# EAGLE design knxhome-lqfp32-v3 (EAGLE 9.4.0)
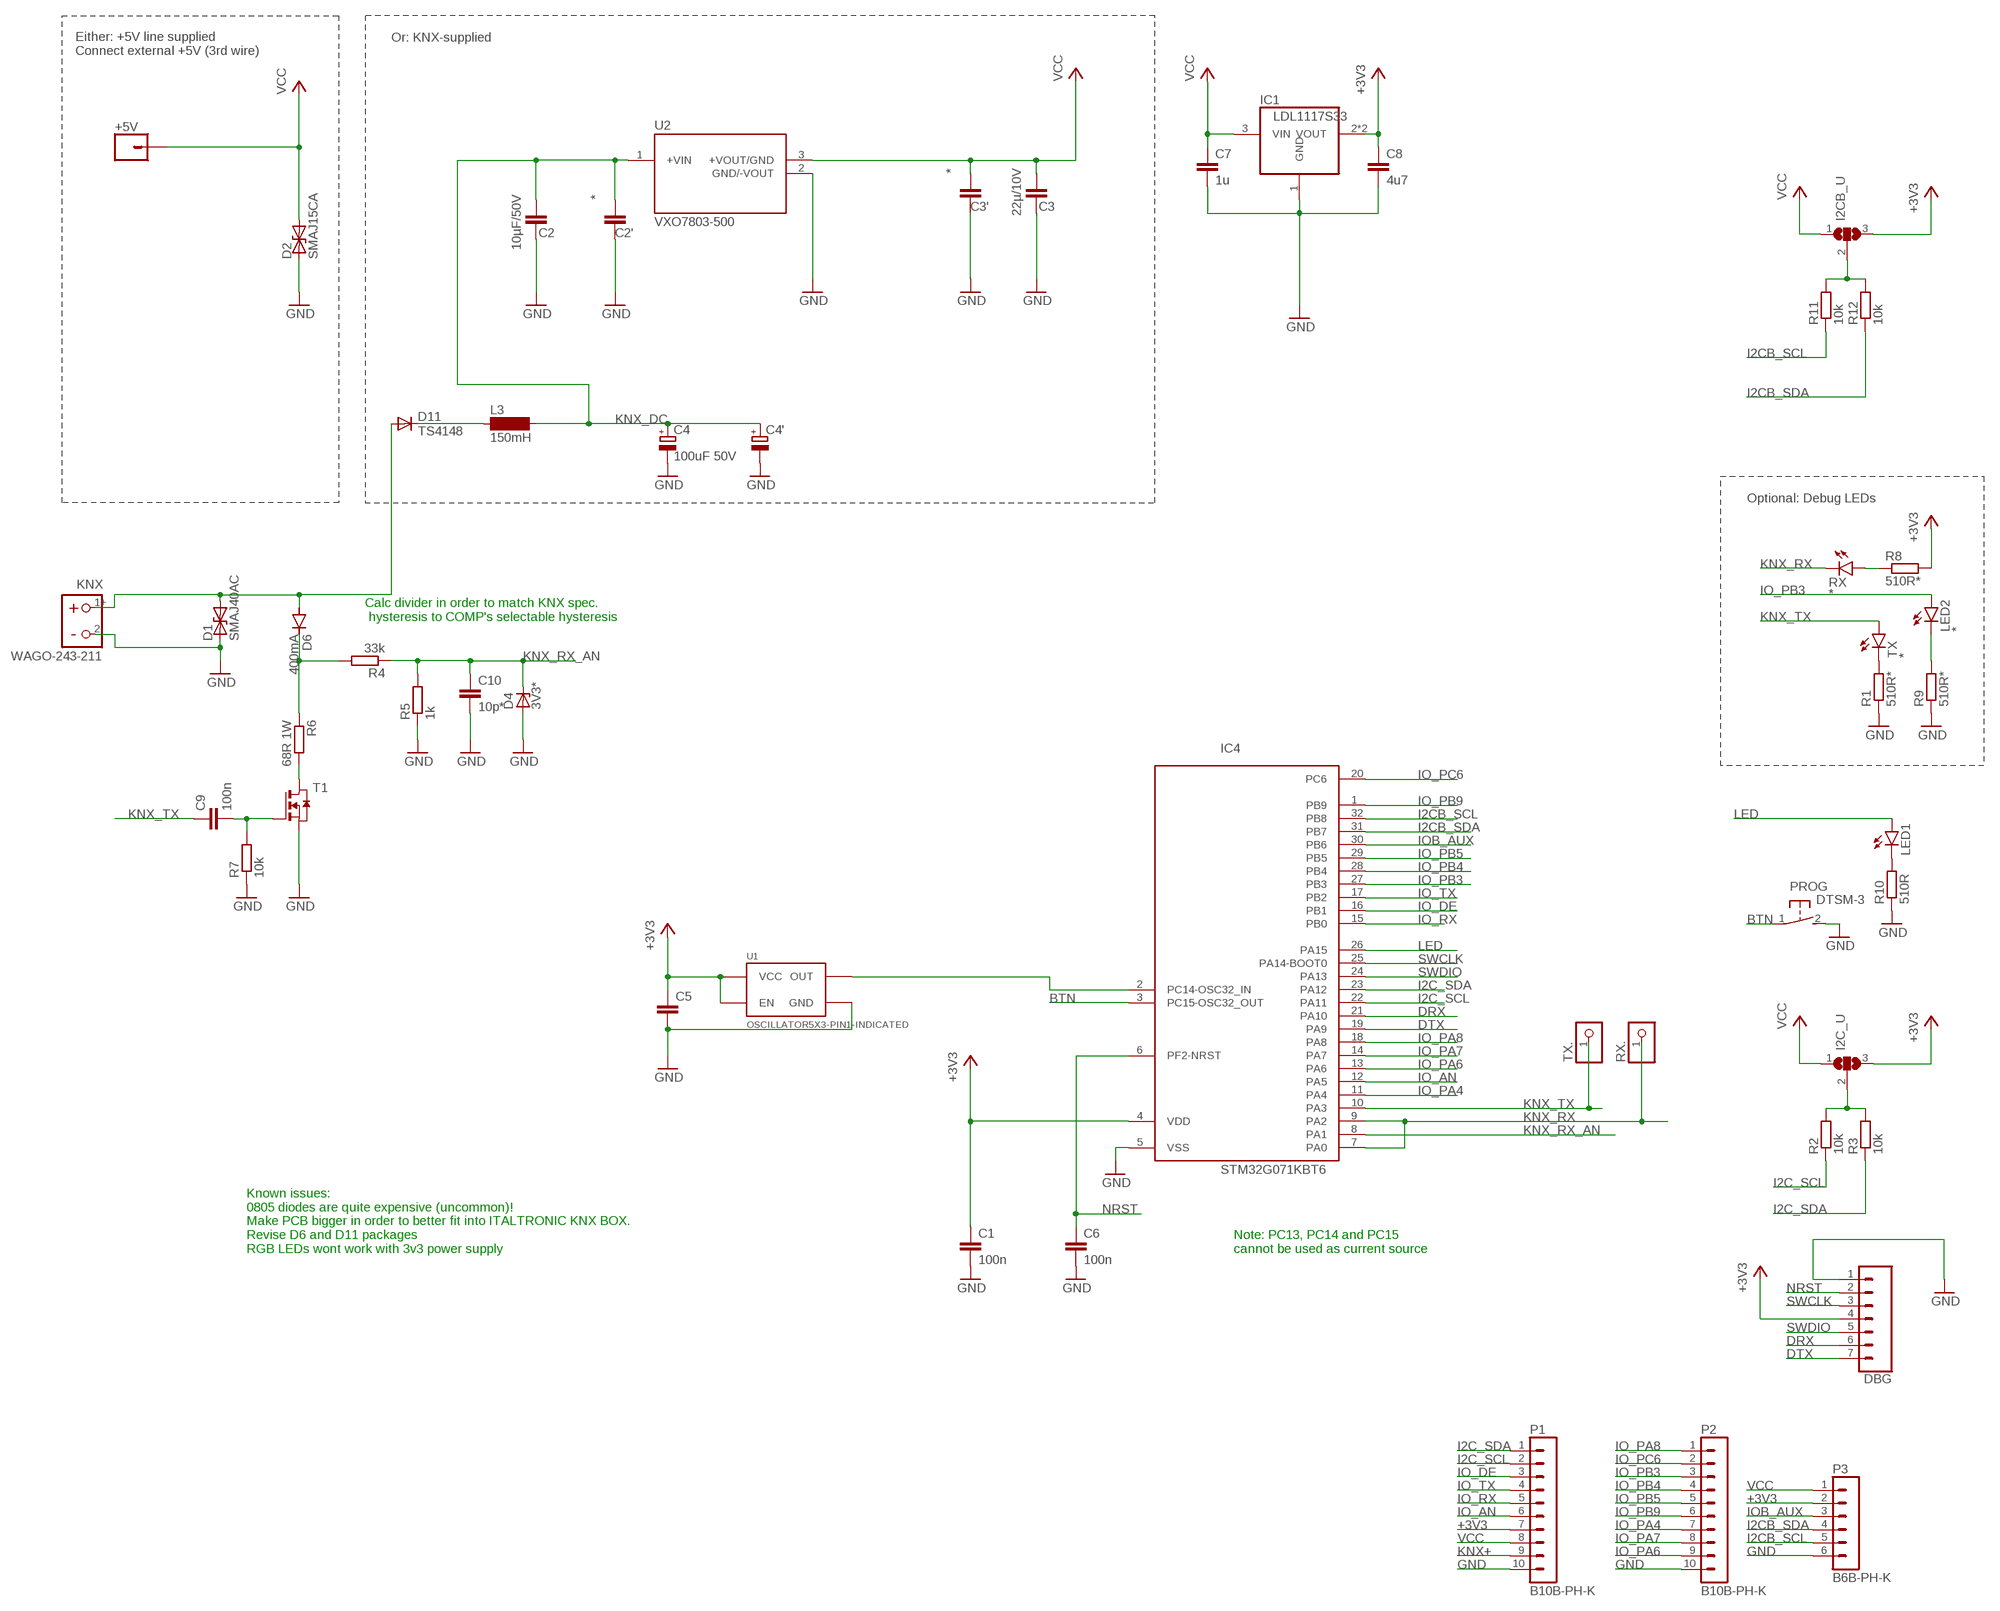
[diagram p0: schematic, sheet 1]

## Parts
+5V  CONN_01PTH_LONGPAD  [1X01_LONGPAD]
C1  100n  C-EUC0805  [C0805]
C2  10µF/50V  C-EUC1210  [C1210]
C2'  *  C-EUC1210  [C1210]
C3  22µ/10V  C-EUC1210  [C1210]
C3'  *  C-EUC1210  [C1210]
C4  100uF 50V  CPOL-EUE3.5-8  [E3,5-8]
C4'  CPOL-EU153CLV-0810  [153CLV-0810]
C5  C-EUC0805  [C0805]
C6  100n  C-EUC0805  [C0805]
C7  1u  C-EUC0805  [C0805]
C8  4u7  C-EUC0805  [C0805]
C9  100n  C-EUC0805  [C0805]
C10  10p*  C-EUC0805  [C0805]
D1  SMAJ40AC  [DO-214AC]
D2  SMAJ15CA  SMAJ40AC  [DO-214AC]
D4  3V3*  ZENER-DIODESOT23  [SOT23]
D6  400mA  DIODE-SOD123  [SOD123]
D11  TS4148  DIODE-SOD123  [SOD123]
DBG  CONN_07LOCK  [1X07_LOCK]
I2C_U  SJ2W  [SJ_2]
I2CB_U  SJ2W  [SJ_2]
IC1  LDL1117S33  REG1117  [SOT223]
IC4  STM32G071KBT6  [LQFP32]
KNX  WAGO-243-211  [WAGO-243-211]
L3  150mH  SD12BS11_LIEGEND  [BS11_LIEGEND]
LED1  LEDCHIPLED_1206  [CHIPLED_1206]
LED2  *  LEDCHIPLED_1206  [CHIPLED_1206]
P1  B10B-PH-K  [B10B-PH-K]
P2  B10B-PH-K  [B10B-PH-K]
P3  B6B-PH-K  [B6B-PH-K]
PROG  DTSM-3  [DTSM-3]
R1  510R*  R-EU_R0805  [R0805]
R2  10k  R-EU_R0805  [R0805]
R3  10k  R-EU_R0805  [R0805]
R4  33k  R-EU_R0805  [R0805]
R5  1k  R-EU_R0805  [R0805]
R6  68R 1W  R-EU_R2512  [R2512]
R7  10k  R-EU_R0805  [R0805]
R8  510R*  R-EU_R0805  [R0805]
R9  510R*  R-EU_R0805  [R0805]
R10  510R  R-EU_R0805  [R0805]
R11  10k  R-EU_R0805  [R0805]
R12  10k  R-EU_R0805  [R0805]
RX  *  LEDCHIPLED_1206  [CHIPLED_1206]
RX.  PINHD-1X1  [1X01]
T1  NMOSSOT23  [SOT-23]
TX  *  LEDCHIPLED_1206  [CHIPLED_1206]
TX.  PINHD-1X1  [1X01]
U1  OSCILLATOR5X3-PIN1-INDICATED  [CRYSTAL-OSC-SMD-5X3]
U2  VXO7803-500  [CONV_VXO7803-500]

## Nets
+3V3: C1.1 C5.1 C8.1 DBG.4 I2C_U.3 I2CB_U.3 IC1.2(VOUT) IC1.4(VOUT) IC4.4(VDD) P1.7 P3.2 R8.2 U1.1(EN) U1.4(VCC)
BTN: IC4.3(PC15-OSC32_OUT) PROG.1
DRX: DBG.6 IC4.21(PA10)
DTX: DBG.7 IC4.19(PA9)
GND: C1.2 C2'.1 C2.1 C3'.1 C3.1 C4'.- C4.- C5.2 C6.2 C7.2 C8.2 C10.2 D1.A D2.A D4.1(A) DBG.1 IC1.1(GND) IC4.5(VSS) KNX.2- P1.10 P2.10 P3.6 PROG.2 R1.1 R5.1 R7.1 R9.1 R10.1 T1.2(S) U1.2(GND) U2.2(GND/-VOUT)
I2C_PUP: I2C_U.2 R2.2 R3.2
I2C_PUP1: I2CB_U.2 R11.2 R12.2
I2C_SCL: IC4.22(PA11) P1.2 R2.1
I2C_SDA: IC4.23(PA12) P1.1 R3.1
I2CB_SCL: IC4.32(PB8) P3.5 R11.1
I2CB_SDA: IC4.31(PB7) P3.4 R12.1
IO_AN: IC4.12(PA5) P1.6
IO_DE: IC4.16(PB1) P1.3
IO_PA4: IC4.11(PA4) P2.7
IO_PA6: IC4.13(PA6) P2.9
IO_PA7: IC4.14(PA7) P2.8
IO_PA8: IC4.18(PA8) P2.1
IO_PB3: IC4.27(PB3) LED2.A P2.3
IO_PB4: IC4.28(PB4) P2.4
IO_PB5: IC4.29(PB5) P2.5
IO_PB9: IC4.1(PB9) P2.6
IO_PC6: IC4.20(PC6) P2.2
IO_RX: IC4.15(PB0) P1.5
IO_TX: IC4.17(PB2) P1.4
IOB_AUX: IC4.30(PB6) P3.3
KNX+ [power]: D1.C D6.A D11.A KNX.1+ P1.9
KNX_DC: C2'.2 C2.2 C4'.+ C4.+ L3.2 U2.1(+VIN)
KNX_RECT: D6.C R4.2 R6.1
KNX_RX: IC4.7(PA0) IC4.9(PA2) RX..1 RX.C
KNX_RX_AN: C10.1 D4.3(C) IC4.8(PA1) R4.1 R5.2
KNX_TX: C9.1 IC4.10(PA3) TX..1 TX.A
LED: IC4.26(PA15) LED1.A
N$1: D11.C L3.1
N$2: LED1.C R10.2
N$3: R1.2 TX.C
N$4: R8.1 RX.A
N$6: LED2.C R9.2
N$7: R6.2 T1.1(D)
N$8: C9.2 R7.2 T1.3(G)
NRST: C6.1 DBG.2 IC4.6(PF2-NRST)
OSC: IC4.2(PC14-OSC32_IN) U1.3(OUT)
SWCLK: DBG.3 IC4.25(PA14-BOOT0)
SWDIO: DBG.5 IC4.24(PA13)
VCC: +5V.1 C3'.2 C3.2 C7.1 D2.C I2C_U.1 I2CB_U.1 IC1.3(VIN) P1.8 P3.1 U2.3(+VOUT/GND)

## Notes on the sheet
- Or: KNX-supplied
- Either: +5V line supplied
  Connect external +5V (3rd wire)
- Optional: Debug LEDs
- Calc divider in order to match KNX spec.
   hysteresis to COMP's selectable hysteresis
- Known issues:
  0805 diodes are quite expensive (uncommon)!
  Make PCB bigger in order to better fit into ITALTRONIC KNX BOX.
  Revise D6 and D11 packages
  RGB LEDs wont work with 3v3 power supply
- Note: PC13, PC14 and PC15 
  cannot be used as current source

## Library data of the parts
+5V = SparkFun-Connectors:CONN_01: Single connection point. Often used as Generic Header-pin footprint for 0.1 inch spaced/style header connections On any of the 0.1 inch spaced packages, you can populate with these: Break Away Headers - Straight <https://www.sparkfun.com/products/116> (PRT-00116) Break Away Male Headers - Right Angle <https://www.sparkfun.com/products/553> (PRT-00553) Female Headers <https://www.sparkfun.com/products/115> (PRT-00115) Break Away Headers - Machine Pin <https://www.sparkfun.com/products/117> (PRT-00117) Break Away Female Headers - Swiss Machine Pin <https://www.sparkfun.com/products/743> (PRT-00743) This device is also useful as a general connection point to wire up your design to another part of your project. Our various solder wires solder well into these plated through hole pads. Hook-Up Wire - Assortment (Stranded, 22 AWG) <https://www.sparkfun.com/products/11375> (PRT-11375) Hook-Up Wire - Assortment (Solid Core, 22 AWG) <https://www.sparkfun.com/products/11367> (PRT-11367) View the entire wire category on our website here <https://www.sparkfun.com/categories/141> Special notes: SMTSO-256-ET is a "flush mount" nut for a 4-40 screw. We mostly use this on specialty testbeds; it is a nice way to connect hardware to your PCB at an adjustable hieght. Also note, the SNAP packages are for using a snappable style connector. We sell a baggie of snaps and they are also used on two LilyPad designs: Snap Assortment - 30 pack (male and female) <https://www.sparkfun.com/products/11347> (DEV-11347) LilyPad Arduino SimpleSnap <https://www.sparkfun.com/products/10941> (DEV-10941) LilyPad SimpleSnap Protoboard <https://www.sparkfun.com/products/10940> (DEV-10940)
C1 C2 C2' C3 C3' C5-C10 = rcl:C-EU: CAPACITOR, European symbol; SPICEPREFIX: C
C4 = rcl:CPOL-EU: POLARIZED CAPACITOR, European symbol
C4' = resistor:CPOL-EU: POLARIZED CAPACITOR, European symbol
D1 D2 = diode:SMAJ40AC
D4 = diode:ZENER-DIODE: Z-Diode
D6 D11 = diode:DIODE-: DIODE
DBG = SparkFun-Connectors:CONN_07: Multi connection point. Often used as Generic Header-pin footprint for 0.1 inch spaced/style header connections On any of the 0.1 inch spaced packages, you can populate with these: Break Away Headers - Straight <https://www.sparkfun.com/products/116> (PRT-00116) Break Away Male Headers - Right Angle <https://www.sparkfun.com/products/553> (PRT-00553) Female Headers <https://www.sparkfun.com/products/115> (PRT-00115) Break Away Headers - Machine Pin <https://www.sparkfun.com/products/117> (PRT-00117) Break Away Female Headers - Swiss Machine Pin <https://www.sparkfun.com/products/743> (PRT-00743) For SCREWTERMINALS and SPRING TERMINALS visit here: Screw Terimnals on SparkFun.com <https://www.sparkfun.com/search/results?term=Screw+Terminals> (5mm/3.5mm/2.54mm spacing) This device is also useful as a general connection point to wire up your design to another part of your project. Our various solder wires solder well into these plated through hole pads. Hook-Up Wire - Assortment (Stranded, 22 AWG) <https://www.sparkfun.com/products/11375> (PRT-11375) Hook-Up Wire - Assortment (Solid Core, 22 AWG) <https://www.sparkfun.com/products/11367> (PRT-11367) View the entire wire category on our website here <https://www.sparkfun.com/categories/141> Special notes: Molex polarized connector foot print use with SKU : PRT-08231 with associated crimp pins and housings. 1MM SMD Version SKU: PRT-10208 NOTES ON THE VARIANTS LOCK and LOCK_LONGPADS... This footprint was designed to help hold the alignment of a through-hole component (i.e. 6-pin header) while soldering it into place. You may notice that each hole has been shifted either up or down by 0.005 of an inch from it's more standard position (which is a perfectly straight line). This slight alteration caused the pins (the squares in the middle) to touch the edges of the holes. Because they are alternating, it causes a "brace" to hold the component in place. 0.005 has proven to be the perfect amount of "off-center" position when using our standard breakaway headers. Although looks a little odd when you look at the bare footprint, once you have a header in there, the alteration is very hard to notice. Also,if you push a header all the way into place, it is covered up entirely on the bottom side.
I2C_U I2CB_U = jumper:SJ2W: SMD solder JUMPER
IC1 = burr-brown:REG1117: 800mA and 1A Low Dropout (LDO) Positive Regulator 1.8V, 2.5V, 2.85V, 3.3V, 5V, and Adj; MPN: REG1117; OC_FARNELL: 1097566; OC_NEWARK: 14P6981
IC4 = stm32g0:STM32G071KBT
KNX = Connector_for_Selfbus-Projects:WAGO-243-211: WAGO KNX-Busklemme
L3 = inductor-neosid:SD12: INDUCTOR nominal inductance
LED1 LED2 RX TX = led:LED: LED OSRAM: - CHIPLED LG R971, LG N971, LY N971, LG Q971, LY Q971, LO R971, LY R971 LH N974, LH R974 LS Q976, LO Q976, LY Q976 LO Q996 - Hyper CHIPLED LW Q18S LB Q993, LB Q99A, LB R99A - SideLED LS A670, LO A670, LY A670, LG A670, LP A670 LB A673, LV A673, LT A673, LW A673 LH A674 LY A675 LS A676, LA A676, LO A676, LY A676, LW A676 LS A679, LY A679, LG A679 - Hyper Micro SIDELED® LS Y876, LA Y876, LO Y876, LY Y876 LT Y87S - SmartLED LW L88C, LW L88S LB L89C, LB L89S, LG L890 LS L89K, LO L89K, LY L89K LS L896, LA L896, LO L896, LY L896 - TOPLED LS T670, LO T670, LY T670, LG T670, LP T670 LSG T670, LSP T670, LSY T670, LOP T670, LYG T670 LG T671, LOG T671, LSG T671 LB T673, LV T673, LT T673, LW T673 LH T674 LS T676, LA T676, LO T676, LY T676, LB T676, LH T676, LSB T676, LW T676 LB T67C, LV T67C, LT T67C, LS T67K, LO T67K, LY T67K, LW E67C LS E67B, LA E67B, LO E67B, LY E67B, LB E67C, LV E67C, LT E67C LW T67C LS T679, LY T679, LG T679 LS T770, LO T770, LY T770, LG T770, LP T770 LB T773, LV T773, LT T773, LW T773 LH T774 LS E675, LA E675, LY E675, LS T675 LS T776, LA T776, LO T776, LY T776, LB T776 LHGB T686 LT T68C, LB T68C - Hyper Mini TOPLED® LB M676 - Mini TOPLED Santana® LG M470 LS M47K, LO M47K, LY M47K Source: http://www.osram.convergy.de LUXEON: - LUMILED® LXK2-PW12-R00, LXK2-PW12-S00, LXK2-PW14-U00, LXK2-PW14-V00 LXK2-PM12-R00, LXK2-PM12-S00, LXK2-PM14-U00 LXK2-PE12-Q00, LXK2-PE12-R00, LXK2-PE12-S00, LXK2-PE14-T00, LXK2-PE14-U00 LXK2-PB12-K00, LXK2-PB12-L00, LXK2-PB12-M00, LXK2-PB14-N00, LXK2-PB14-P00, LXK2-PB14-Q00 LXK2-PR12-L00, LXK2-PR12-M00, LXK2-PR14-Q00, LXK2-PR14-R00 LXK2-PD12-Q00, LXK2-PD12-R00, LXK2-PD12-S00 LXK2-PH12-R00, LXK2-PH12-S00 LXK2-PL12-P00, LXK2-PL12-Q00, LXK2-PL12-R00 Source: www.luxeon.com KINGBRIGHT: KA-3528ASYC Source: www.kingbright.com
P1 P2 = con-jst-ph:B10B-PH-K: HEADER
P3 = con-jst-ph:B6B-PH-K: HEADER
PROG = switch-tact:DTSM-3
R1-R12 = rcl:R-EU_: RESISTOR, European symbol; SPICEPREFIX: R
RX. TX. = pinhead:PINHD-1X1: PIN HEADER
T1 = zetex:NMOSSOT23: MOS FET; OC_FARNELL: unknown; OC_NEWARK: unknown
U1 = SparkFun-FreqCtrl:OSCILLATOR: Generic 5x3 and 7x5 oscillators
U2 = VXO7803-500:VXO7803-500; MANUFACTURER: CUI Inc; PARTREV: 1.0; STANDARD: Manufacturer recommendations

## Net classes
1 power: width 0.305 mm

## Board
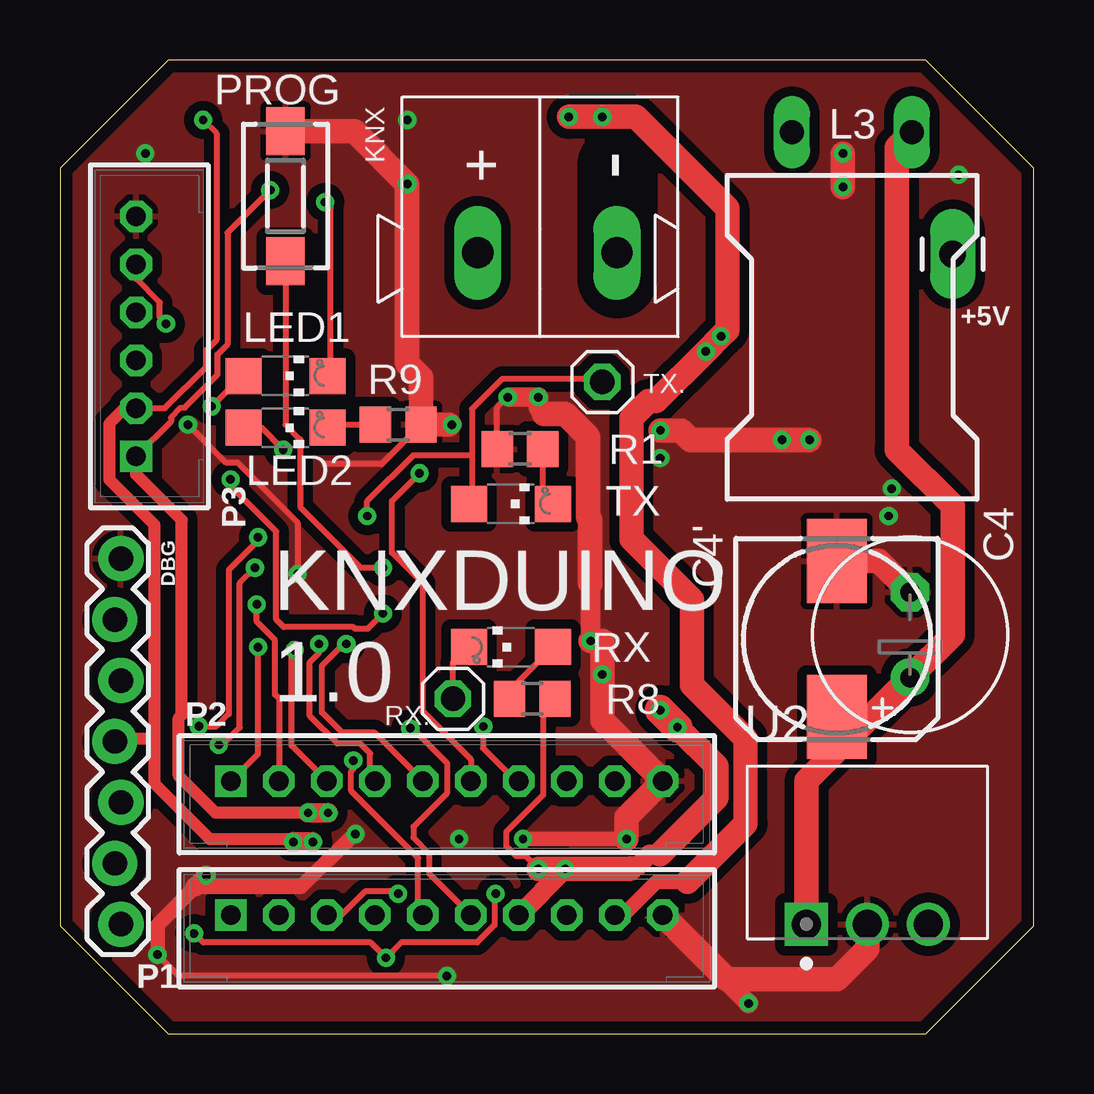
[diagram p1: board, top side]
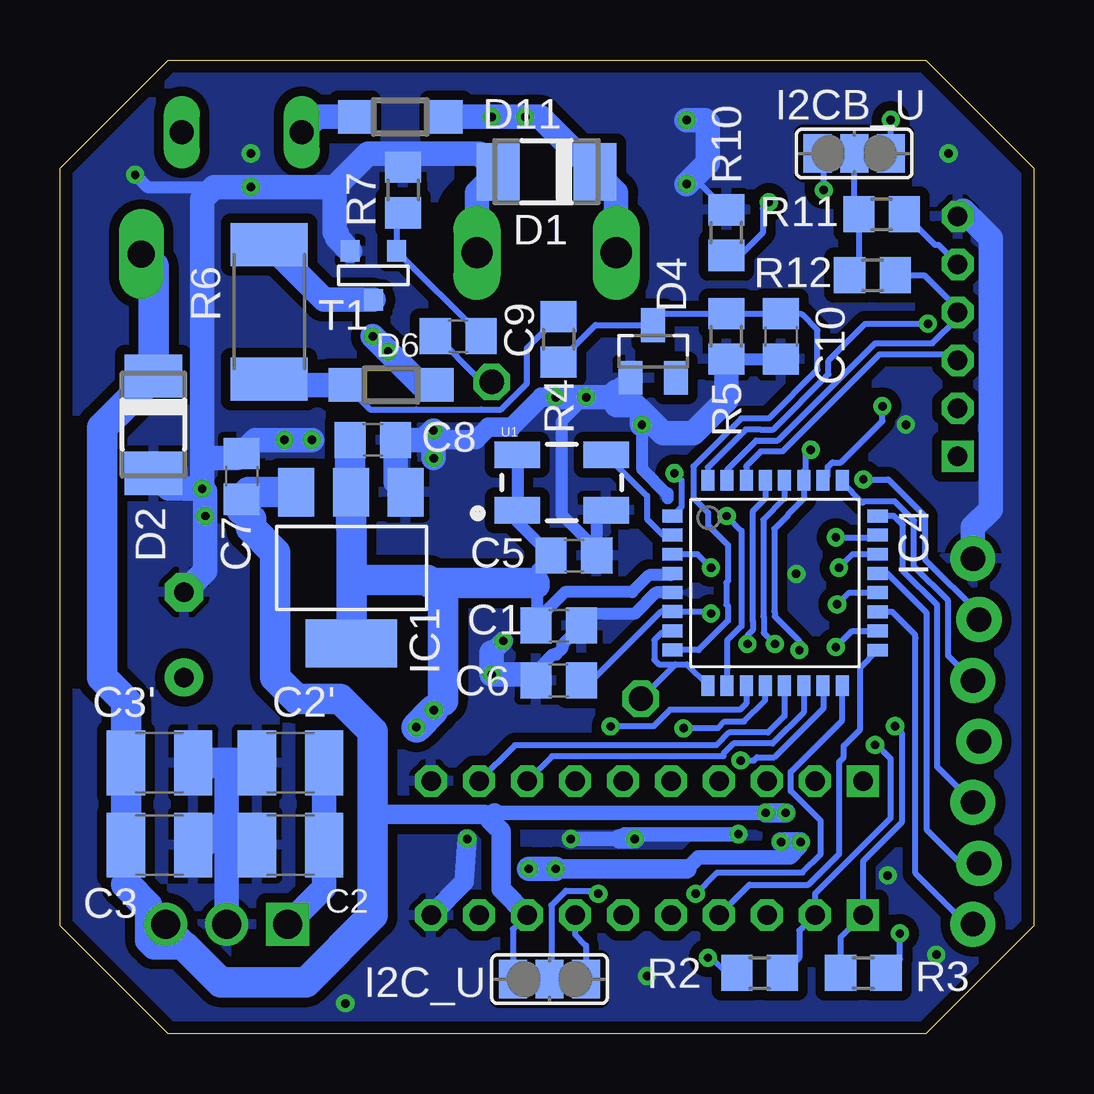
[diagram p2: board, bottom side, seen from below]

Size 40.6 x 40.6 mm. Coordinates in mm from the lower left corner, seen from the top.
Outline: 40.6,4.5 40.6,36.1 36.1,40.6 4.5,40.6 0,36.1 0,4.5 4.5,0 36.1,0 40.6,4.5
Copper layers (1*16): Top 0.035mm / dielectric 1.5mm / Bottom 0.035mm
Design rules "default *": minimum track width 8mil, minimum drill 0.35mm, track to track 8mil, track to pad 8mil, pad to pad 6mil, via to via 8mil, smd to smd 6mil, copper to edge 20mil, drill to drill 6mil, minimum pad ring 10mil, minimum via ring 8mil, stop-mask expansion 4mil, vias tented up to drill 40mil, thermal gap 10mil
tRestrict: 1 lines
bRestrict: 3 lines

### Footprints (pad centres in the part's own frame; a part is rotated, then mirrored left to right if it is on the bottom)
1X01_LONGPAD = drill 1.118 pad 1.88 long: 1 0,0
C0805 = smd 1.3 x 1.5: 1 -0.95,0; 2 0.95,0
C1210 = smd 1.6 x 2.7: 1 -1.4,0; 2 1.4,0
E3,5-8 = drill 0.813 pad 1.6: + -1.778,0 | drill 0.813 pad 1.6 octagon: - 1.778,0
153CLV-0810 = smd 3.5 x 2.5: + 3.25,0; - -3.25,0
DO-214AC = smd 1.8 x 2.4: A 2.025,0; C -2.025,0
SOT23 = smd 1 x 1.4: 1 -0.95,-1.1; 2 0.95,-1.1; 3 0,1.1
SOD123 = smd 1.4 x 1.4: A 1.9,0; C -1.9,0
1X07_LOCK = drill 1.016 pad 1.88: 1 0,0.127; 2 2.54,-0.127; 3 5.08,0.127; 4 7.62,-0.127; 5 10.16,0.127; 6 12.7,-0.127; 7 15.24,0.127
SJ_2 = smd 1.168 x 1.6: 1 -1.524,0; 2 0,0; 3 1.524,0
SOT223 = smd 1.499 x 2.007: 1 -2.261,-3.15; 2 0.025,-3.15; 3 2.311,-3.15 | smd 3.81 x 2.007: 4 0,3.15
LQFP32 = smd 0.54 x 0.85: 1 -2.8,-4.275; 2 -2,-4.275; 3 -1.2,-4.275; 4 -0.4,-4.275; 5 0.4,-4.275; 6 1.19,-4.275; 7 1.99,-4.275; 8 2.79,-4.275; 17 2.8,4.275; 18 2,4.275; 19 1.2,4.275; 20 0.4,4.275; 21 -0.4,4.275; 22 -1.2,4.275; 23 -2,4.275; 24 -2.8,4.275 | smd 0.85 x 0.54: 9 4.275,-2.8; 10 4.275,-2; 11 4.275,-1.2; 12 4.275,-0.4; 13 4.275,0.4; 14 4.275,1.2; 15 4.275,2; 16 4.275,2.8; 25 -4.275,2.8; 26 -4.275,2; 27 -4.275,1.2; 28 -4.275,0.4; 29 -4.275,-0.4; 30 -4.275,-1.2; 31 -4.275,-2; 32 -4.275,-2.8
WAGO-243-211 = drill 1.3 long: 1+ 0,2.65; 2- 0,-3.15
BS11_LIEGEND = drill 1 long: 1 -2.5,0; 2 2.5,0
CHIPLED_1206 = smd 1.5 x 1.5: A 0,-1.75; C 0,1.75
B10B-PH-K = drill 0.813 square: 1 -9,0 | drill 0.813 octagon: 2 -7,0; 3 -5,0; 4 -3,0; 5 -1,0; 6 1,0; 7 3,0; 8 5,0; 9 7,0; 10 9,0
B6B-PH-K = drill 0.813 square: 1 -5,0 | drill 0.813 octagon: 2 -3,0; 3 -1,0; 4 1,0; 5 3,0; 6 5,0
DTSM-3 = smd 2 x 1.6: 1 -2.7,0; 2 2.7,0
R0805 = smd 1.3 x 1.5: 1 -0.95,0; 2 0.95,0
R2512 = smd 1.8 x 3.2: 1 -2.8,0; 2 2.8,0
1X01 = drill 1.016 octagon: 1 0,0
SOT-23 = smd 0.787 x 0.889: 1 0.025,-1.016; 2 -0.94,1.016; 3 0.991,1.016
CRYSTAL-OSC-SMD-5X3 = smd 1.9 x 1.1: 1 -1.85,-1.15; 2 1.85,-1.15; 3 1.85,1.15; 4 -1.85,1.15
CONV_VXO7803-500 = drill 1.2 square: 1 0,0 | drill 1.2: 2 2.54,0; 3 5.08,0

### Placement (x,y rotation side)
+5V  37.21,32.51 180 top
C1  19.81,17.02 0 bottom
C2  30.99,7.87 0 bottom
C2'  30.99,11.3 0 bottom
C3  36.45,7.87 180 bottom
C3'  36.45,11.3 180 bottom
C4  35.43,16.64 90 top
C4'  32.38,16.46 270 top
C5  19.18,19.94 0 bottom
C6  19.81,14.73 180 bottom
C7  33.02,23.24 90 bottom
C8  27.56,24.77 0 bottom
C9  24,29.08 0 bottom
C10  10.54,29.08 270 bottom
D1  20.32,35.94 180 bottom
D2  36.7,25.4 270 bottom
D4  15.88,28.45 0 bottom
D6  26.8,27.05 0 bottom
D11  26.42,38.23 0 bottom
DBG  2.41,19.81 270 top
I2C_U  20.19,2.29 0 bottom
I2CB_U  7.49,36.7 0 bottom
IC1  28.45,19.43 180 bottom
IC4  10.79,18.8 270 bottom
KNX  20.07,32.56 90 top
L3  33.02,37.59 0 top
LED1  9.4,27.43 270 top
LED2  9.4,25.27 270 top
P1  16.13,4.95 0 top
P2  16.13,10.54 0 top
P3  3.17,29.08 90 top
PROG  9.4,34.92 90 top
R1  19.18,24.38 0 top
R2  11.43,2.54 180 bottom
R3  7.11,2.54 0 bottom
R4  19.81,28.96 90 bottom
R5  12.83,29.08 90 bottom
R6  31.88,30.1 90 bottom
R7  26.29,35.18 270 bottom
R8  19.68,13.97 0 top
R9  14.1,25.4 180 top
R10  12.83,33.4 270 bottom
R11  6.35,34.16 180 bottom
R12  6.73,31.62 180 bottom
RX  18.8,16.13 90 top
RX.  16.38,13.97 0 top
T1  27.56,31.62 0 bottom
TX  18.8,22.1 270 top
TX.  22.61,27.18 0 top
U1  19.68,22.99 0 bottom
U2  31.11,4.57 0 top

### Tracks (layer width: path | path; a pad name or v marks a point on that pad's centre or on a via)
+3V3  (via drill 0.35)
  Top 0.254: R8.2 20.14,13.47 20.14,9.96 18.6,8.42 18.6,7.83 19.01,7.42 19.4,7.42 v19.94,6.88 | P3.2 4.37,26.08 6.11,27.83 6.11,28.51 6.53,28.93 6.53,37.54 v5.97,38.1
  Top 0.508: v9.72,8 9.6,8.13 6.25,8.13 3.94,10.44 3.94,12.32 | P3.2 2.7,26.08 2.06,25.44 2.06,23.11 3.94,21.23 3.94,12.32 | DBG.4 2.41,12.32 3.94,12.32
  Top 0.813: P1.7 v21.06,6.88 | v9.72,8 v10.54,8 | 23.78,6.91 23.88,7.01 24.09,7.01 24.57,7.49 25.02,7.49
  Top 1.016: v25.74,12.78 27.36,11.17 27.36,9.83 25.02,7.49 | v19.94,6.88 v21.06,6.88 23.75,6.88 23.78,6.91
  Top 1.27: v25.02,13.5 v25.74,12.78
  Bottom 0.254: P1.7 19.13,4.14 18.67,3.68 I2C_U.3 | I2CB_U.3 v5.97,38.1
  Bottom 0.508: U1.4 U1.1 21.54,21.35 C5.1 20.7,19.36 20.7,18.67 20.7,17.08 C1.1 20.76,17.21 19.56,18.41 16.75,18.41 16.05,19.12 15.14,19.12 IC4.4
  Bottom 0.61: 14.46,6.88 13.98,7.37 10.16,7.37 9.72,7.8 v9.72,8
  Bottom 0.813: v19.94,6.88 14.46,6.88 | v9.72,8 v10.54,8
  Bottom 1.016: IC1.2 28.51,22.62 | 24.64,18.29 25.15,18.8 25.27,18.92 | v25.02,13.5 24.64,13.88 | 20.83,18.8 20.7,18.67 | v21.06,6.88 v19.94,6.88 | 28.47,21.11 28.45,21.08
  Bottom 1.27: 28.51,22.62 C8.1 | 24.64,18.29 24.64,13.88 | 25.15,18.8 20.83,18.8 | IC1.4 28.45,18.92 | 28.45,18.92 28.45,21.08 | IC1.2 28.47,21.11 | 25.27,18.92 28.45,18.92 | v25.02,13.5 v25.74,12.78
BTN  (via drill 0.35)
  Top 0.254: PROG.1 9.53,32.1 9.4,31.97 9.4,25.4 10.01,24.79 10.01,21.98 12.55,19.43 v13.46,19.43
  Bottom 0.254: IC4.3 14.03,20 v13.46,19.43
DRX
  Bottom 0.254: DBG.6 3.07,7.11 4.49,8.53 4.49,17.57 6.12,19.2 IC4.21
DTX
  Bottom 0.254: DBG.7 2.81,4.57 4.94,6.7 4.94,16.5 4.95,16.51 4.95,16.64 5.91,17.6 IC4.19
GND  (via drill 0.35)
  Top 0.254: v16.13,2.41 4.95,2.41 v4.06,3.3 | R1.1 18.23,26.1 v18.67,26.54 | v5.33,25.4 6.91,23.82 7.41,23.82 9.91,21.32 v9.91,19.18 | R9.1 13.4,23.75 11.05,23.75
  Top 0.61: v23.62,8.13 v19.3,8.13 | v4.06,3.3 4.06,4.55 5.63,6.12 10.06,6.12 12.27,8.33 v12.32,8.33
  Top 0.813: 22.12,18.78 v22.12,16.38 | 20.18,25.84 19.94,26.09 v19.94,26.54 18.71,26.54 | 27.8,2.29 27.8,2.18 v28.7,1.27 | 22.01,21.55 22.1,21.46 | v6.1,6.6 6.1,6.59 5.63,6.12 | v16.34,25.4 16.21,25.4
  Top 1.016: PROG.2 12.29,37.62 v14.48,35.43 14.48,27.94 15.05,27.37 R9.1 16.21,25.4 | v25.03,25.16 25.89,25.16 26.29,24.77 v30.1,24.77 v31.24,24.77 | v32.64,35.31 v32.64,36.7 | v22.12,16.38 22.61,16.38 v22.61,14.99 22.61,13.06 P2.10 23.62,9.03 v23.62,8.13 | P1.10 27.8,2.29 32.38,2.29 33.66,3.56 U2.2 | 22.1,21.46 22.1,18.8 22.12,18.78 | C4'.- 34.14,19.71 C4.- | 20.18,25.84 21.07,25.84 22.01,24.91 22.01,21.55
  Bottom 0.254: R10.1 14.03,35.56 14.03,35.88
  Bottom 0.508: R5.1 C10.2 | IC4.5 15.77,18.4 16.64,17.53 18.35,17.53 C1.2 19.66,16.23 19.66,16.08 19.92,15.81 20.07,15.81 20.76,15.12 C6.2 | U1.2 18.23,21.45 18.23,20.19 | 18.23,20.19 C5.2 | v18.67,26.54 19.68,25.53 19.68,21.65 18.23,20.19 | v37.47,35.81 36.96,35.31 34.16,35.31 | 33.78,11.3 33.66,11.43 | v16.34,25.4 16.34,23.54 15.33,22.53 15.27,22.53 15.27,22.32
  Bottom 0.61: v19.3,8.13 17.27,8.13 17.07,8.33 v12.32,8.33
  Bottom 0.813: v19.94,26.54 20.54,26.54 21.78,25.3 22.74,25.3 23.26,24.78 24.65,24.78 v25.03,25.16 | P1.10 23.75,6.33 v23.62,8.13 | D4.1 17.4,26.77 17.4,26.23 | 22.61,15.89 v22.12,16.38 | 17.27,8.13 v16.64,8.13
  Bottom 1.016: KNX.2- 23.22,35.07 D1.A 23.11,36.7 26.29,36.7 | T1.2 29.06,33.2 29.06,33.33 29.15,33.42 29.15,35.31 | 29.15,35.31 v32.64,35.31 34.16,35.31 34.67,34.8 34.67,24 | 34.67,24 v34.67,22.73 | 34.67,24 33.21,24 C7.2 32.45,24.77 v31.24,24.77 v30.1,24.77 | IC1.1 26.61,23 C8.2 25.43,24.77 v25.03,25.16 25.03,24.02 v25.02,24 | P3.6 2.94,34.31 1.8,33.17 1.8,21.86 2.54,21.12 DBG.1 | v14.48,35.43 14.03,35.88 13.59,36.32 13.59,37.97 13.72,38.1 v14.48,38.1 | 17.4,26.23 16.64,26.23 16.34,25.92 | 16.34,25.92 15.47,25.05 14.2,25.05 12.83,26.42 R5.1 | v19.94,26.54 v18.67,26.54 17.63,26.54 17.4,26.77 | C6.2 21.02,14.99 v22.61,14.99 22.61,15.89 | v34.67,22.73 34.54,22.61 v34.54,21.59 34.54,19.3 C4.- | D2.A 36.06,22.73 v34.67,22.73 | 33.66,11.43 33.66,8.76 | 33.66,8.76 33.91,8.76 33.66,8.51 | 33.66,8.51 33.02,7.87 C2.1 | U2.2 33.66,8.51 | 33.66,8.76 34.54,7.87 C3.1 | 26.29,36.7 R7.1 | 29.15,35.31 27.75,36.7 26.29,36.7 | v16.34,25.4 16.34,25.92
  Bottom 1.27: C3'.1 33.78,11.3 C2'.1
  other vias: 3.56,36.7
  pour Top (isolate 0.406): 0,36.1 0,4.5 4.5,0 36.1,0 40.6,4.5 40.6,36.1 36.1,40.6 4.5,40.6
  pour Bottom (isolate 0.406): 0,36.1 0,4.5 4.5,0 36.1,0 40.6,4.5 40.6,36.1 36.1,40.6 4.5,40.6
I2C_PUP  (via drill 0.35)
  Top 0.254: v5.59,4.19 5.97,3.81 12.95,3.81 v13.59,3.17 14.22,3.81 17.39,3.81 18.12,4.54 18.12,5.8 v18.16,5.84
  Bottom 0.254: R3.2 5.59,3.11 v5.59,4.19 | I2C_U.2 20.12,2.36 20.12,5.36 19.51,5.97 18.29,5.97 v18.16,5.84 | R2.2 12.83,2.54 13.46,3.17 v13.59,3.17
I2C_PUP1
  Bottom 0.254: R12.2 7.3,32 R11.2 7.49,34.36 I2CB_U.2
I2C_SCL  (via drill 0.35)
  Top 0.254: v8.13,19.43 7.49,18.8 7.49,12.77 6.77,12.05 v6.62,12.05
  Bottom 0.254: R2.1 10.41,2.54 9.78,3.17 9.78,4.3 P1.2 9.13,5.84 5.97,9 5.97,11.47 6.55,12.05 v6.62,12.05 | v8.13,19.43 7.56,20 IC4.22
I2C_SDA  (via drill 0.35)
  Top 0.254: v8.26,20.7 8.26,20.56 7.04,19.34 7.04,13.34 6.53,12.83 v5.79,12.83
  Bottom 0.254: R3.1 8.06,4.02 P1.1 7.13,7.2 5.51,8.81 5.51,12.55 v5.79,12.83 | v8.26,20.7 6.62,20.7 IC4.23
I2CB_SCL  (via drill 0.35)
  Top 0.254: v4.42,29.61 4.17,29.86 4.17,30.49 3.17,31.48 P3.5
  Bottom 0.254: IC4.32 13.6,23.62 12.01,25.2 11.43,25.2 10.86,25.2 8.56,27.5 8.56,28.07 7.02,29.61 v4.42,29.61 | R11.1 4.13,32.89 3.98,32.89 P3.5
I2CB_SDA
  Bottom 0.254: IC4.31 12.79,23.52 11.57,24.74 10.67,24.74 6.62,28.79 4.23,28.79 3.17,29.84 P3.4 3.17,30.23 4.57,31.62 R12.1
IO_AN  (via drill 0.35)
  Top 0.254: P1.6 15.39,6.69 15.39,7.53 14.73,8.18 14.73,8.64 16.13,10.03 16.13,11.3 14.69,12.74 v14.61,12.74
  Bottom 0.254: IC4.12 11.2,13.9 12.08,13.02 12.9,13.02 13.18,12.74 v14.61,12.74
IO_DE  (via drill 0.35)
  Top 0.254: v14.1,5.84 13.99,5.94 12.72,5.94 11.73,4.95 P1.3
  Bottom 0.254: v14.1,5.84 13.21,6.73 9.65,6.73 8.89,7.49 8.89,8.89 10.13,10.13 10.14,10.13 10.14,10.93 8,13.08 IC4.16
IO_PA4  (via drill 0.35)
  Top 0.254: P2.7 19,10.54 17.63,11.92 17.65,11.92 v17.65,12.82
  Bottom 0.254: IC4.11 11.99,13.78 12.26,13.51 15.18,13.51 15.87,12.82 v17.65,12.82
IO_PA6
  Bottom 0.254: IC4.13 10.39,13.25 11.08,12.56 12.71,12.56 13.24,12.03 21.64,12.03 P2.9
IO_PA7
  Bottom 0.254: IC4.14 9.6,13.4 10.89,12.1 12.52,12.1 12.94,11.69 12.94,11.58 20.09,11.58 P2.8
IO_PA8  (via drill 0.35)
  Top 0.254: P2.1 8.26,11.67 v8.26,16.13
  Bottom 0.254: v8.26,16.13 7.59,16.8 IC4.18
IO_PB3  (via drill 0.35)
  Top 0.254: P2.3 9.65,12.02 9.65,15.88 v9.78,16 | LED2.A 8.41,25.27 8.82,24.86 8.82,24.83 v9.3,24.35
  Bottom 0.254: v9.78,16 9.78,16.38 10.8,17.41 10.8,17.59 10.82,17.61 10.82,21.06 10.24,21.64 10.24,21.67 9.6,22.31 IC4.27 9.6,23.45 9.52,23.52 9.52,24.13 v9.3,24.35
IO_PB4  (via drill 0.35)
  Top 0.254: P2.4 12.94,10.73 12.94,11.69 12.52,12.1 11.57,12.1 10.41,13.26 10.41,15.49 10.79,15.88 v10.79,16.26
  Bottom 0.254: IC4.28 10.39,22.31 11.28,21.43 11.28,17.42 11.26,17.4 11.26,16.72 v10.79,16.26
IO_PB5  (via drill 0.35)
  Top 0.254: P2.5 13.11,12.56 11.76,12.56 10.92,13.39 10.92,15.36 11.82,16.26 v11.94,16.26
  Bottom 0.254: IC4.29 11.2,22.31 11.73,21.77 11.73,17.23 11.71,17.21 11.71,16.83 11.94,16.61 v11.94,16.26
IO_PB9  (via drill 0.35)
  Top 0.254: v14.99,23.37 13.84,22.23 13.84,20.07 15.11,18.8 15.11,13.46 17.13,11.45 P2.6
  Bottom 0.254: IC4.1 14.69,21.98 14.69,23.07 v14.99,23.37
IO_PC6  (via drill 0.35)
  Top 0.254: P2.2 9.13,13.98 8.96,14.15 8.96,16.42 8.2,17.18 v8.2,17.91
  Bottom 0.254: v8.2,17.91 7.71,18.4 IC4.20
IO_RX  (via drill 0.35)
  Top 0.254: v12.23,11.39 12.23,11.04 12.14,10.95 12.14,10.13 14.93,7.34 14.93,5.15 P1.5
  Bottom 0.254: v12.23,11.39 11.68,11.39 11.54,11.53 10.82,11.53 8.76,13.59 8.76,14.49 IC4.15
IO_TX
  Bottom 0.254: P1.4 11.86,6.22 9.4,6.22 8.12,7.5 8.12,11.34 7.93,11.53 7.93,12.01 7.24,12.7 7.24,15.28 IC4.17
IOB_AUX
  Bottom 0.254: P3.3 3.43,28.34 6.43,28.34 10.48,24.28 11.38,24.28 11.99,23.67 IC4.30
KNX+  (via drill 0.35)
  Top 0.61: P1.9 23.48,4.95 24.87,6.35 26.16,6.35
  Top 1.016: 26.16,6.35 28.57,8.76 28.57,12.32 26.34,14.55 26.34,18.11 23.81,20.64 23.81,25.66 24.53,26.38 24.85,26.38 v26.92,28.45 v27.56,29.08 27.81,29.34 27.81,34.42 24,38.23 v22.61,38.23 v21.21,38.23
  Bottom 1.016: D11.A v22.61,38.23 v21.21,38.23 20.58,38.23 D1.C 17.42,35.06 KNX.1+ | v27.56,29.08 v26.92,28.45 25.53,27.05 D6.A
KNX_DC
  Top 1.016: L3.2 34.88,36.96 34.88,24.34 37.21,22.02 37.21,16.64 C4.+ 33.78,13.21 | U2.1 31.11,10.54 33.78,13.21 | C4'.+ 33.78,13.21
  Bottom 0.508: C2'.2 29.59,10.41
  Bottom 1.016: U2.1 29.59,6.1 C2.2 29.59,10.41
KNX_RECT
  Bottom 0.254: D6.C 27.68,26.04 25.75,26.04 25.73,26.02 23.05,26.02 23.04,26.03 22.21,26.03 21.13,27.11 21.13,28.59 R4.2
  Bottom 1.016: R6.1 31.63,27.05 D6.C
KNX_RX
  Top 0.254: RX..1 16.38,15.47 RX.C
  Bottom 0.254: IC4.7 15.14,16.73 15.51,16.73 15.82,16.41 15.82,15.6 15.63,15.41 14.95,15.41 | IC4.9 14.48,15.41 14.95,15.41 | RX..1 14.95,15.41
KNX_RX_AN
  Bottom 0.254: R4.1 18.27,29.55 D4.3 15.39,30.03 R5.2 C10.1 10.54,30 9.68,30 9.02,29.34 9.02,27.69 11.05,25.65 12.2,25.65 14.2,23.66 14.2,22.33 13.59,21.73 13.59,21.21 12.75,20.37 12.75,18.88 12.83,18.81 12.83,17.89 12.75,17.82 12.75,17.23 13.98,16.01 IC4.8
KNX_TX  (via drill 0.35)
  Top 0.254: v12.81,21.59 12.81,22.2 14.73,24.13 17.17,24.13 | 17.17,24.13 17.17,26.05 18.43,27.3 22.48,27.3 TX..1 | 17.17,24.13 17.17,22.23 TX.A
  Bottom 0.254: C9.1 24.95,29.02 24.82,29.02 24.03,28.22 24.03,28.2 23.02,27.18 TX..1 | IC4.10 12.79,16.4 12.19,17 12.19,20.98 v12.81,21.59
LED  (via drill 0.35)
  Top 0.254: v6.32,26.16 7.59,27.43 LED1.A
  Bottom 0.254: v6.32,26.16 6.32,25.55 8.04,23.83 8.4,23.83 8.6,23.63 8.6,23.27 IC4.26
N$1
  Bottom 1.016: L3.1 29.89,38.23 D11.C
N$2  (via drill 0.35)
  Top 0.254: LED1.C 11.29,27.57 11.29,34.43 v11.05,34.67
  Bottom 0.254: v11.05,34.67 11.3,34.42 11.3,33.4 12.25,32.45 R10.2
N$3
  Top 0.254: TX.C 20.13,22.52 R1.2
N$4
  Top 0.254: R8.1 18.73,14.32 RX.A
N$6
  Top 0.254: LED2.C 11.28,25.4 R9.2
N$7
  Bottom 1.016: T1.1 29.59,30.61 R6.2
N$8
  Bottom 0.254: R7.2 26.57,33.95 T1.3 23.05,29.12 C9.2
NRST  (via drill 0.35)
  Top 0.254: v7.11,23.11 7.11,22.85 9.02,20.94 9.02,17.27 9.32,16.96 12.23,16.96 12.3,16.89 12.83,16.89 v13.46,17.53
  Bottom 0.254: C6.1 18.41,14.73 15.54,17.61 IC4.6 13.46,17.61 v13.46,17.53 | v7.11,23.11 6.07,23.11 4.55,21.59 4.55,19.79 2.29,17.53 DBG.2
OSC
  Bottom 0.254: U1.3 16.13,22.43 16.13,21.46 15.46,20.8 IC4.2
SWCLK
  Bottom 0.254: DBG.3 3.57,15.76 3.57,18.06 5,19.49 5,21.4 5.8,22.2 7.08,22.2 7.15,22.13 8,22.98 IC4.25
SWDIO
  Bottom 0.254: DBG.5 4.03,11.14 4.03,17.87 5.46,19.3 5.46,21.21 5.85,21.6 IC4.24
VCC  (via drill 0.35)
  Top 0.254: P3.1 4.63,25.53 4.63,25.69 5.04,26.11 5.2,26.11 6.57,27.48 6.57,28.32 6.99,28.74 6.99,33.4 v8.76,35.18
  Top 0.508: v10.34,9.21 6.49,9.21 4.95,10.75 4.95,13.17 5.08,13.3 5.08,21.42 3.17,23.32 P3.1
  Top 0.813: v10.34,9.21 v11.18,9.21
  Bottom 0.254: P1.8 21.72,4.37 I2C_U.1 | v8.76,35.18 8.76,36.45 I2CB_U.1
  Bottom 0.508: C3'.2 37.85,12.7
  Bottom 0.61: v11.18,9.21 22.48,9.21
  Bottom 0.813: P1.8 22.23,6.05 22.23,8.47 22.5,8.74 | 22.5,8.74 22.9,9.14 27.3,9.14 27.56,8.89 | 22.48,9.21 22.5,9.2 22.5,8.74 | v10.34,9.21 v11.18,9.21
  Bottom 1.016: C7.1 32.73,22.58 | +5V.1 36.7,32 | 32.64,21.46 33.02,21.84 | 37.85,6.23 C3.2 | U2.3 36.96,5.33 36.96,3.87 36.7,3.62 35.37,3.62 35.24,3.62 U2.3
  Bottom 1.27: 32.73,22.58 IC1.3 | 36.7,32 D2.C 38.85,25.28 38.85,14.87 37.85,13.87 37.85,12.7 C3.2 | 33.02,21.84 C7.1 | 36.96,5.33 37.85,6.23 | 35.37,3.62 33.91,2.16 30.34,2.16 27.56,4.94 27.56,8.89 27.56,12.61 28.92,13.97 30.73,13.97 31.62,14.86 31.62,20.07 32.64,21.08 32.64,21.46

### Text on the board
tNames: KNXDUINO / 1.0